# EAGLE design neojoint2-090 (EAGLE 6.6.0)
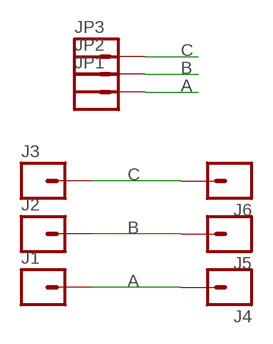
[diagram p0: schematic, sheet 1]

## Parts
J1  M01SMD-4.5X1.5  [PAD-1.5X4.5]
J2  M01SMD-4.5X1.5  [PAD-1.5X4.5]
J3  M01SMD-4.5X1.5  [PAD-1.5X4.5]
J4  M01SMD-4.5X1.5  [PAD-1.5X4.5]
J5  M01SMD-4.5X1.5  [PAD-1.5X4.5]
J6  M01SMD-4.5X1.5  [PAD-1.5X4.5]
JP1  M01PTH  [1X01]
JP2  M01PTH  [1X01]
JP3  M01PTH  [1X01]

## Nets
A: J1.P$1 J4.P$1 JP1.1
B: J2.P$1 J5.P$1 JP2.1
C: J3.P$1 J6.P$1 JP3.1

## Library data of the parts
J1-J6 JP1-JP3 = SparkFun-Connectors:M01: Header 1 Standard 1-pin 0.1" header. Use with straight break away headers (SKU : PRT-00116), right angle break away headers (PRT-00553), swiss pins (PRT-00743), machine pins (PRT-00117), and female headers (PRT-00115).

## Board
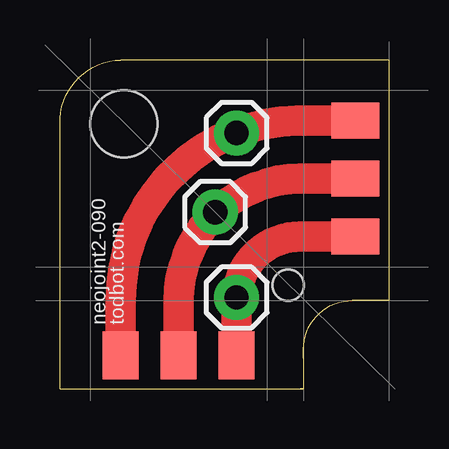
[diagram p1: board, top side]

Size 13.72 x 13.72 mm. Coordinates in mm from the lower left corner, seen from the top.
Outline: 10.03,0 0,0 0,11.05 arc-90 2.54,13.72 13.72,13.72 13.72,3.68 12.19,3.68 arc90 10.16,1.65 10.16,1.27 10.16,0
Outline: 10.03,0 10.16,0
Outline: 10.16,0 10.03,0
Copper layers (1*16): Top 0.0356mm / dielectric 1.5011mm / Bottom 0.0356mm
Design rules "LaenPCBOrder-tod": minimum track width 10mil, minimum drill 13mil, track to track 6mil, track to pad 8mil, pad to pad 8mil, via to via 8mil, smd to smd 6mil, copper to edge 15mil, drill to drill 8mil, minimum pad ring 7mil, minimum via ring 7mil, stop-mask expansion 4mil, vias tented up to drill 25mil, thermal gap 10mil
Holes 2.8 mm at 2.67,11.05
Holes 1.3 mm at 9.53,4.32

### Footprints (pad centres in the part's own frame; a part is rotated, then mirrored left to right if it is on the bottom)
PAD-1.5X4.5 = smd 1.5 x 2: P$1 0,0
1X01 = drill 1.016 pad 1.88: 1 0,0

### Placement (x,y rotation side)
J1  7.37,1.4 0 top
J2  4.95,1.4 0 top
J3  12.32,11.18 270 top
J4  12.32,6.35 270 top
J5  12.32,8.76 270 top
J6  2.54,1.4 0 top
JP1  7.37,3.81 0 top
JP2  6.48,7.37 0 top
JP3  7.37,10.67 0 top

### Tracks (layer width: path | path; a pad name or v marks a point on that pad's centre or on a via)
A
  Top 0.406: JP1.1 J1.P$1
  Top 1.27: J4.P$1 10.29,6.35 10.03,6.35 arc90 7.37,3.68 J1.P$1
B
  Top 0.406: JP2.1 10.03,8.76
  Top 1.27: J5.P$1 10.16,8.76 10.03,8.76 arc90 4.95,3.68 J2.P$1
C
  Top 0.406: JP3.1 9.91,11.18
  Top 1.27: J6.P$1 2.41,1.52 2.54,1.52 2.54,3.68 arc-90 9.91,11.18 J3.P$1 11.81,11.18

### Text on the board
tPlace: neojoint2-090 | todbot.com